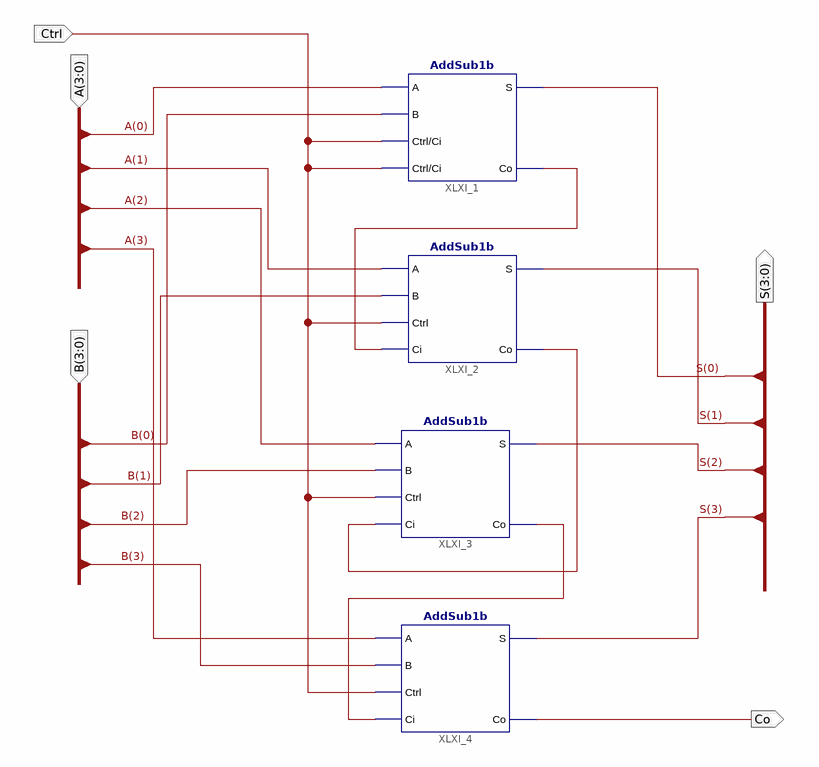
[diagram p0: schematic sheet 1]
// Xilinx ISE schematic AddSub4b_sch.sch (kintex7) as structural Verilog: 4 symbols, 5 ports
module AddSub4b_sch (
  input  Ctrl,
  input  [3:0] A,
  input  [3:0] B,
  output Co,
  output [3:0] S
);

  wire XLXN_1, XLXN_2, XLXN_3;

  AddSub1b XLXI_1 (.A(A[0]), .B(B[0]), .Ctrl(Ctrl), .Ci(Ctrl), .S(S[0]), .Co(XLXN_1));
  AddSub1b XLXI_2 (.A(A[1]), .B(B[1]), .Ctrl(Ctrl), .Ci(XLXN_1), .S(S[1]), .Co(XLXN_2));
  AddSub1b XLXI_3 (.A(A[2]), .B(B[2]), .Ctrl(Ctrl), .Ci(XLXN_2), .S(S[2]), .Co(XLXN_3));
  AddSub1b XLXI_4 (.A(A[3]), .B(B[3]), .Ctrl(Ctrl), .Ci(XLXN_3), .S(S[3]), .Co(Co));
endmodule
